# Altium schematic sheet Sheet1.SchDoc
size A4; SheetNumber: 1; SheetTotal: 1
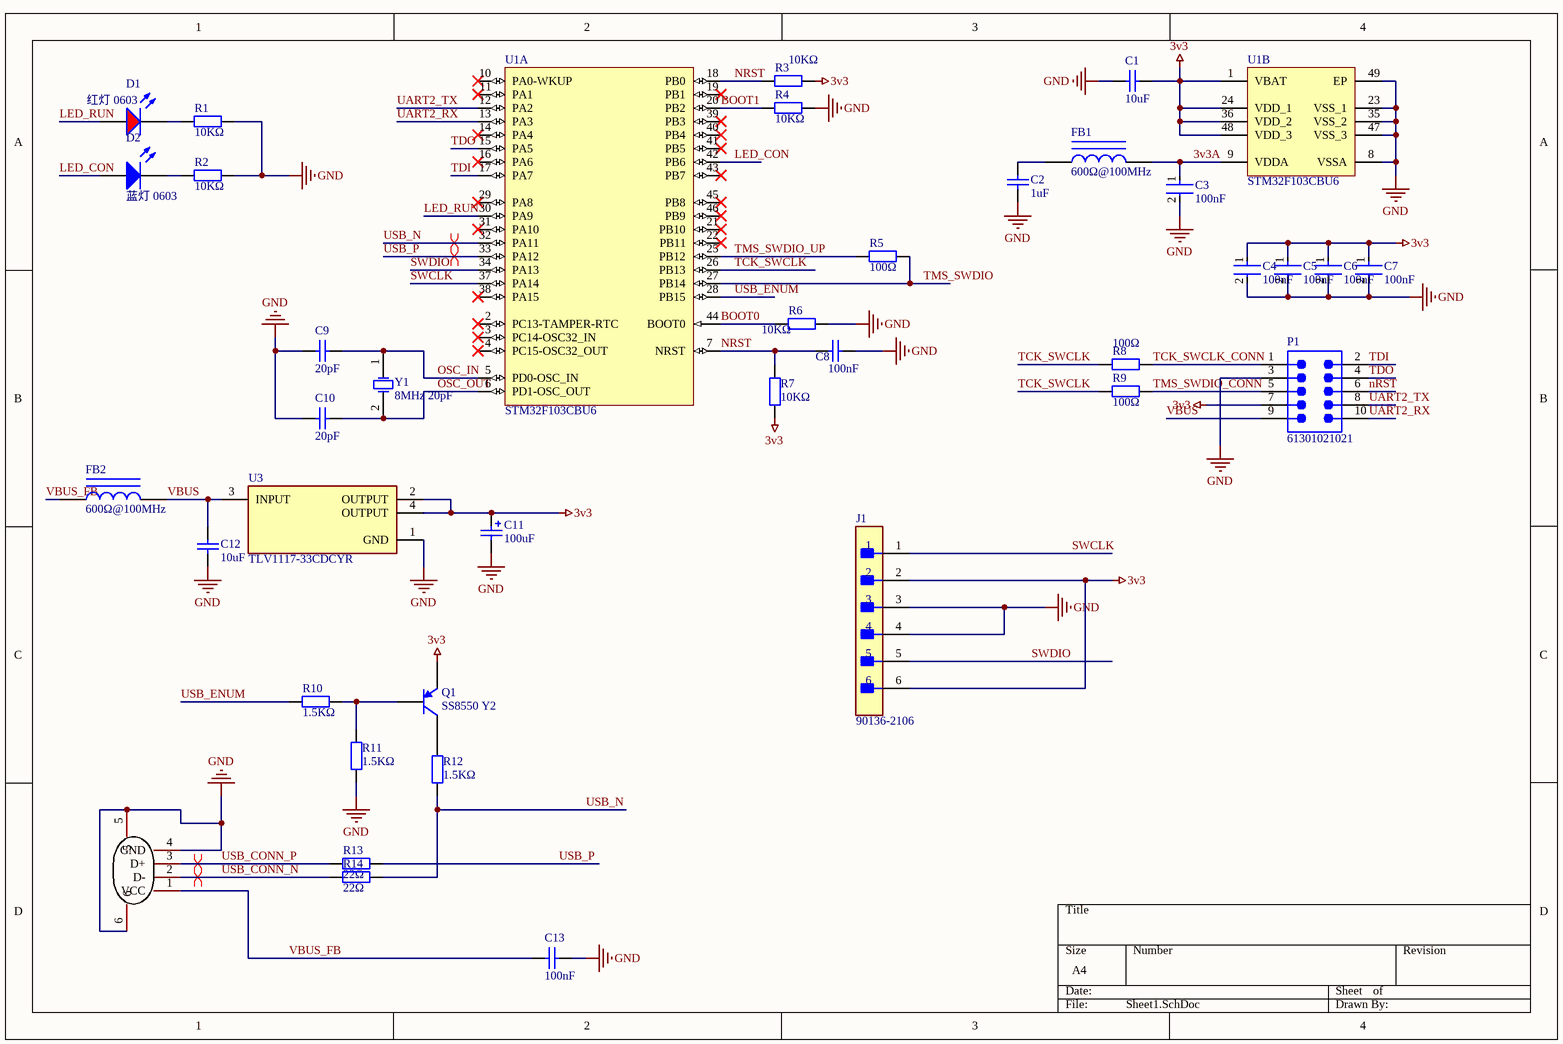
[diagram p0: Sheet1.SchDoc]

## Parts
C1  10uF  [0603_C]
C2  1uF  [0603_C]
C3  100nF  [FP-CL779-IPC_C]
C4  100nF  [FP-CL779-IPC_C]
C5  100nF  [FP-CL779-IPC_C]
C6  100nF  [FP-CL779-IPC_C]
C7  100nF  [FP-CL779-IPC_C]
C8  100nF  [0603_C]
C9  20pF  [0603_C]
C10  20pF  [0603_C]
C11  100uF  [CASE-B_3528]
C12  10uF  [0603_C]
C13  100nF  [0603_C]
D1  红灯 0603  [0603_LED_S1]
D2  蓝灯 0603  [0603_LED_S1]
FB1  600Ω@100MHz  [0603_L]
FB2  600Ω@100MHz  [0603_L]
J1  90136-2106  [FP-90136-2106-MFG]
P1  61301021021  [61301021021]
Q1  SS8550 Y2  [SOT-23(SOT-23-3)]
R1  10KΩ  [0603_R]
R2  10KΩ  [0603_R]
R3  10KΩ  [0603_R]
R4  10KΩ  [0603_R]
R5  100Ω  [0603_R]
R6  10KΩ  [0603_R]
R7  10KΩ  [0603_R]
R8  100Ω  [0603_R]
R9  100Ω  [0603_R]
R10  1.5KΩ  [0603_R]
R11  1.5KΩ  [0603_R]
R12  1.5KΩ  [0603_R]
R13  22Ω  [0402_R]
R14  22Ω  [0402_R]
U1  STM32F103CBU6  [STM-UFQFPN48_N]  (parts A,B of 2)
U3  TLV1117-33CDCYR  [FP-DCY0004A-IPC_C]
USB1  U217-041N-4BV81  [USB-A-SMD_U217-041N-4BV81]  (value not drawn)
Y1  8MHz 20pF  [SMD-5032_2P]

## Nets
3v3: C1.2 C4.1 C5.1 C6.1 C7.1 C11.1 J1.2 J1.6 P1.7 Q1.2(E) R3.2 R7.1 U1.1(VBAT) U1.24(VDD_1) U1.36(VDD_2) U1.48(VDD_3) U3.2(OUTPUT) U3.4(OUTPUT)
GND: C1.1 C2.1 C3.2 C4.2 C5.2 C6.2 C7.2 C8.2 C9.1 C10.1 C11.2 C12.1 C13.2 J1.3 J1.4 P1.3 R1.2 R2.2 R4.2 R6.2 R11.1 U1.8(VSSA) U1.23(VSS_1) U1.35(VSS_2) U1.47(VSS_3) U1.49(EP) U3.1(GND) USB1.4(GND) USB1.5 USB1.6
3v3A: C3.1 FB1.2 U1.9(VDDA)
BOOT0: R6.1 U1.44(BOOT0)
BOOT1: R4.1 U1.20(PB2)
LED_CON: D2.A U1.42(PB6)
LED_RUN: D1.A U1.30(PA9)
NRST: C8.1 P1.6 R3.1 R7.2 U1.7(NRST) U1.18(PB0)
OSC_IN: C9.2 U1.5(PD0-OSC_IN) Y1.1(OSC1)
OSC_OUT: C10.2 U1.6(PD1-OSC_OUT) Y1.2(OSC2)
SWCLK: J1.1 U1.37(PA14)
SWDIO: J1.5 U1.34(PA13)
TCK_SWCLK: R8.1 R9.1 U1.26(PB13)
TCK_SWCLK_CONN: P1.1 R8.2
TDI: P1.2 U1.17(PA7)
TDO: P1.4 U1.15(PA5)
TMS_SWDIO: R5.2 U1.27(PB14)
TMS_SWDIO_CONN: P1.5 R9.2
TMS_SWDIO_UP: R5.1 U1.25(PB12)
UART2_RX: P1.10 U1.13(PA3)
UART2_TX: P1.8 U1.12(PA2)
USB_CONN_N: R14.1 USB1.2(D-)
USB_CONN_P: R13.1 USB1.3(D+)
USB_ENUM: R10.2 U1.28(PB15)
USB_N: R12.1 R14.2 U1.32(PA11)
USB_P: R13.2 U1.33(PA12)
VBUS: C12.2 FB2.2 P1.9 U3.3(INPUT)
VBUS_FB: C13.1 FB2.1 USB1.1(VCC)
NetC2_2: C2.2 FB1.1
NetD1_K: D1.K R1.1
NetD2_K: D2.K R2.1
NetQ1_1: Q1.1(B) R10.1 R11.2
NetQ1_3: Q1.3(C) R12.2

Not connected (* = marked no-connect by the designer): U1 2(PC13-TAMPER-RTC)* 3(PC14-OSC32_IN)* 4(PC15-OSC32_OUT)* 10(PA0-WKUP)* 11(PA1)* 14(PA4)* 16(PA6)* 19(PB1)* 21(PB10)* 22(PB11)* 29(PA8)* 31(PA10)* 38(PA15)* 39(PB3)* 40(PB4)* 41(PB5)* 43(PB7)* 45(PB8)* 46(PB9)*

## Layout directives
differential pair: USB_CONN_N, USB_CONN_P, USB_N, USB_P

## Library data of the parts
C1 C12 = 0603 10uF (106) 10% 10V: 贴片电容; ComponentLink1Description: 供应商链接; ComponentLink1URL: http://www.szlcsc.com/product/details_20411.html; Package: 0603; Supplier: LC; SuppliersPartNumber: C19702
C2 = 0603 1uF (105) 10% 50V: 贴片电容1uF (105) 10% 50V CL10A105KB8NNNC; ComponentLink1Description: 供应商链接; ComponentLink1URL: http://www.szlcsc.com/product/details_16531.html; Package: 0603; Supplier: LC; SuppliersPartNumber: C15849
C3-C7 = CMP-13271-002336-1: CL05B104KB54PNC Cap Ceramic 100nF 50V X7R ±10% SMD 0402 +125°C Paper T/R
C8 C13 = 0603 100nF (104) 10% 50V: 贴片电容; ComponentLink1Description: 供应商链接; ComponentLink1URL: http://www.szlcsc.com/product/details_15331.html; Package: 0603; Supplier: LC; SuppliersPartNumber: C14663
C9 C10 = 0603 20pF (200) 5% 50V: 贴片电容; ComponentLink1Description: 供应商链接; ComponentLink1URL: http://www.szlcsc.com/product/details_2000.html; Package: 0603; Supplier: LC; SuppliersPartNumber: C1648
C11 = 3528 100uF (107) 10% 6.3V: 钽电容; ComponentLink1Description: 供应商链接; ComponentLink1URL: http://www.szlcsc.com/product/details_16815.html; Package: 3528; Supplier: LC; SuppliersPartNumber: C16133
D1 = 0603 红灯: 发光二极管; ComponentLink1Description: 供应商链接; ComponentLink1URL: http://www.szlcsc.com/product/details_2659.html; Package: 0603; Supplier: LC; SuppliersPartNumber: C2286
D2 = 0603 蓝灯: 发光二极管; ComponentLink1Description: 供应商链接; ComponentLink1URL: http://www.szlcsc.com/product/details_73150.html; Package: 0603; Supplier: LC; SuppliersPartNumber: C72041
FB1 FB2 = 0603 600Ω 25% 100MHz: 贴片磁珠GZ1608D601TF; ComponentLink1Description: 供应商链接; ComponentLink1URL: http://www.szlcsc.com/product/details_1354.html; Package: 0603; Supplier: LC; SuppliersPartNumber: C1002
J1 = CMP-04776-000069-1: CONN HEADER R/A 6POS 2.54MM; Manufacturer: Molex; Number Of Contacts: 6; Current Rating: 3A; Voltage Rating: 350V; Conn Gender: Male; Conn Orientation: Right Angle; RoHS: TRUE; Temperature Range Low: -55°C; Package: 0; ComponentLink2Description: Datasheet; Category: Conn; Automotive: No; Device Class L1: Connectors; Device Class L3: unset; Height: 7.51mm; Digikey Description: CONN HEADER R/A 6POS 2.54MM; Footprint Url: https://www.molex.com/pdm_docs/sd/901362106_sd.pdf; Temperature: -55°C to +125°C; Temperature Range High: +125°C; Pitch: 2.54mm; Contact Material: Tin,Nickel; Mouser Description: Headers & Wire Housings 2.54MM CGRIDIII HDR 6P R/A SR SHRD TIN; Number Of Rows: 1; Manufacturer Part Number: 90136-2106; Octopart: https://octopart.com/90136-2106-molex-655558; ComponentLink2URL: http://www.molex.com/webdocs/datasheets/pdf/en-us/0901362106_PCB_HEADERS.pdf; Lead Free: Yes; Device Class L2: Headers and Wire Housings
P1 = CMP-1502-01083-2: NexarPartId: 18818162; Contact Resistance: 20mΩ; Insulation: Insulated; Voltage Rating: 250V; Gender: Male; Pitch: 2.54mm; Current Rating: 3A; Number of Contacts: 10; Connector Type: Male Pin; Insulation Resistance: 1GΩ; RoHS: Compliant; Contact Plating: Gold; Housing Material: PBT; Contact Mating Length: 5.9944mm; Color: Black; Mount: Through Hole; Orientation: Right Angle; Termination: Through Hole; Lead Pitch: 2.54mm; Packaging: Bulk; Row Spacing: 2.54mm; Height: 2.54mm; Min Operating Temperature: -40°C; Number of Positions: 10; Flammability Rating: UL94 V-0; REACH SVHC: Unknown; Contact Material: Copper; Operating Supply Voltage: 250V; Number of Rows: 2; Contact Gender: Male; Max Operating Temperature: 125°C; Number of Pins: 10; Width: 12.7mm; Length: 12.7mm
Q1 = SOT-23 SS8550 Y2: 三极管; ComponentLink1Description: 供应商链接; ComponentLink1URL: http://www.szlcsc.com/product/details_9037.html; Package: SOT-23; Supplier: LC; SuppliersPartNumber: C8542
R1 R2 R6 R7 = 0603 10KΩ (1002) 1%: 贴片电阻; ComponentLink1Description: 供应商链接; ComponentLink1URL: http://www.szlcsc.com/product/details_26547.html; Package: 0603; Supplier: LC; SuppliersPartNumber: C25804
R3 R4 = 0603 10KΩ (1002) 1%: 贴片电阻 0603WAF1002T5E; ComponentLink1Description: 供应商链接; ComponentLink1URL: http://www.szlcsc.com/product/details_26547.html; Package: 0603; Supplier: LC; SuppliersPartNumber: C25804
R5 R8 R9 = 0603 100Ω (1000) 1%: 贴片电阻; ComponentLink1Description: 供应商链接; ComponentLink1URL: http://www.szlcsc.com/product/details_23502.html; Package: 0603; Supplier: LC; SuppliersPartNumber: C22775
R10-R12 = 0603 1.5KΩ (1501) 1%: 贴片电阻; ComponentLink1Description: 供应商链接; ComponentLink1URL: http://www.szlcsc.com/product/details_23570.html; Package: 0603; Supplier: LC; SuppliersPartNumber: C22843
R13 R14 = 0402 22Ω (22R0) 1%: 贴片电阻; ComponentLink1Description: 供应商链接; ComponentLink1URL: http://www.szlcsc.com/product/details_25835.html; Package: 0402; Supplier: LC; SuppliersPartNumber: C25092
U1 = CMP-0237-00051-3: ARM Cortex-M3 32-bit MCU, 128 KB Flash, 20 KB Internal RAM, 37 I/Os, 48-pin UFQFPN, -40 to 85 degC, Tray; I/Os (High Current): 37; Supply Voltage(Vcc) min (V): 2; FLASH Size (Prog) (kB): 128; Operating Frequency(F) (Processor speed) (MHz): 72; A/D Converter: 2x12-bit (10 Channel); Internal RAM Size (kB): 20; DatasheetVersion: Rev. 16; ComponentLink2Description: Datasheet; ComponentLink3Description: Package Specification; ComponentLink1URL: http://www.st.com/web/en/home.html; PackageVersion: Rev. 1, 04/2013; ComponentLink2URL: http://www.st.com/st-web-ui/static/active/en/resource/technical/document/datasheet/CD00161566.pdf; PackageDescription: 48-Pin Ultra Thin Fine Pitch Quad Flat No-Lead, 7 x 7 x 0.6 mm Body, 0.5 mm Pitch, Exposed Pad; Mounting Technology: Surface Mount; Packing: Tray; Core: ARM Cortex-M3; ComponentLink3URL: http://www.st.com/st-web-ui/static/active/en/resource/technical/document/data_brief/DM00071938.pdf; PackageReference: UFQFPN48; ComponentLink1Description: Manufacturer URL; PartNumber: STM32F103CBU6
U3 = CMP-04917-000080-1: IC REG LIN 3.3V 800MA SOT223-4
USB1 = U217-041N-4BV81: Manufacturer: XKB Connectivity(中国星坤); Symbol: U217-04XN-XXR84; Add into BOM: yes; Connector Type: Type-A; Gender: 公头; Number of Contacts: 4P; Number of Ports: 1; Current Rating - Power (Max): 1.5A; Name: U217-041N-4BV81; Device: U217-041N-4BV81; LCSC Part Name: Type-A 公头 沉板; Supplier Part: C319178; Manufacturer Part: U217-041N-4BV81; Supplier Footprint: SMD; JLCPCB Part Class: Extended Part; Datasheet: https://atta.szlcsc.com/upload/public/pdf/source/20211015/D42E73CBE112FBE216C7DAC502068881.pdf; Supplier: LCSC; Convert to PCB: yes; Standard: USB 2.0; Mounting Style: 沉板; Contact Material: 黄铜; Contact Plating: 金; Operating Temperature Range: -40℃~+85℃; Welding Temperature (Max): -
Y1 = SMD-5032_2P 8MHz 20ppm 20pF: 贴片晶振; ComponentLink1Description: 供应商链接; ComponentLink1URL: http://www.szlcsc.com/product/details_117214.html; Package: SMD-5032_2P; Supplier: LC; SuppliersPartNumber: C115962